# Altium schematic sheet MGMEZZ04_LoopBack.SchDoc
size Letter
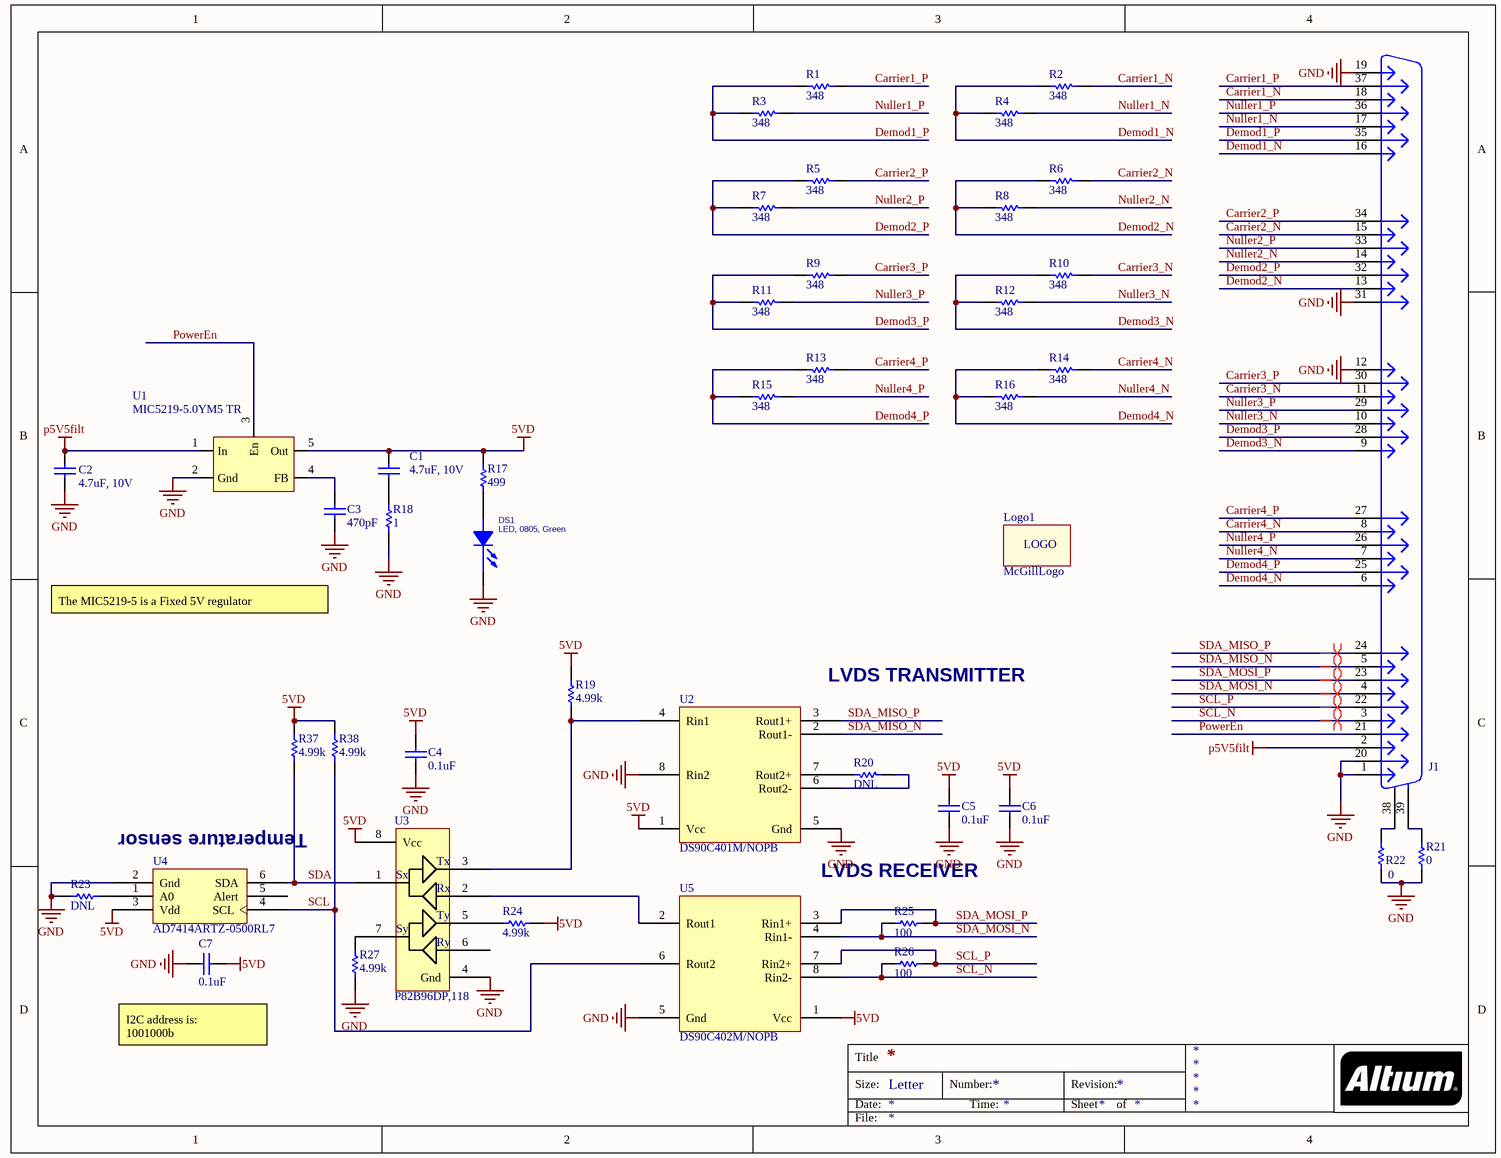
[diagram p0: MGMEZZ04_LoopBack.SchDoc]

## Parts
C1  4.7uF, 10V  [0805]
C2  4.7uF, 10V  [0805]
C3  470pF  [0603]
C4  0.1uF  [0603]
C5  0.1uF  [0603]
C6  0.1uF  [0603]
C7  0.1uF  [0603]
DS1  LED, 0805, Green  [0805L]
J1  DB37M  [DSUB37-M]  (value not drawn)
Logo1  McGillLogo  [McGillLogo1]  (no BOM)
R1  348  [0603]
R2  348  [0603]
R3  348  [0603]
R4  348  [0603]
R5  348  [0603]
R6  348  [0603]
R7  348  [0603]
R8  348  [0603]
R9  348  [0603]
R10  348  [0603]
R11  348  [0603]
R12  348  [0603]
R13  348  [0603]
R14  348  [0603]
R15  348  [0603]
R16  348  [0603]
R17  499  [0603]
R18  1  [0603]
R19  4.99k  [0603]
R20  DNL  [0603]
R21  0  [0603]
R22  0  [0603]
R23  DNL  [0603]
R24  4.99k  [0603]
R25  100  [0603]
R26  100  [0603]
R27  4.99k  [0603]
R37  4.99k  [0603]
R38  4.99k  [0603]
U1  MIC5219-5.0YM5 TR  [SOT23-5]
U2  DS90C401M/NOPB  [SO8]
U3  P82B96DP,118  [MSOP8-P82B96]
U4  AD7414ARTZ-0500RL7  [SOT23-6]
U5  DS90C402M/NOPB  [SO8]

## Nets
5VD: C1.2 C4.2 C5.2 C6.2 C7.2 R17.1 R19.2 R24.2 R37.2 R38.2 U1.5(Out) U2.1(Vcc) U3.8(Vcc) U4.3(Vdd) U5.1(Vcc)
GND: C2.1 C3.1 C4.1 C5.1 C6.1 C7.1 DS1.2(CATHODE) J1.1 J1.12 J1.19 J1.20 J1.31 R18.1 R21.2 R22.1 R23.2 R27.1 U1.2(Gnd) U2.5(Gnd) U2.8(Rin2) U3.4(Gnd) U4.2(Gnd) U5.5(Gnd)
p5V5filt: C2.2 J1.2 U1.1(In)
Carrier1_N: J1.18 R2.2
Carrier1_P: J1.37 R1.2
Carrier2_N: J1.15 R6.2
Carrier2_P: J1.34 R5.2
Carrier3_N: J1.11 R10.2
Carrier3_P: J1.30 R9.2
Carrier4_N: J1.8 R14.2
Carrier4_P: J1.27 R13.2
Demod1_N: J1.16 R2.1 R4.1
Demod1_P: J1.35 R1.1 R3.1
Demod2_N: J1.13 R6.1 R8.1
Demod2_P: J1.32 R5.1 R7.1
Demod3_N: J1.9 R10.1 R12.1
Demod3_P: J1.28 R9.1 R11.1
Demod4_N: J1.6 R14.1 R16.1
Demod4_P: J1.25 R13.1 R15.1
Nuller1_N: J1.17 R4.2
Nuller1_P: J1.36 R3.2
Nuller2_N: J1.14 R8.2
Nuller2_P: J1.33 R7.2
Nuller3_N: J1.10 R12.2
Nuller3_P: J1.29 R11.2
Nuller4_N: J1.7 R16.2
Nuller4_P: J1.26 R15.2
PowerEn: J1.21 U1.3(En)
SCL: R38.1 U4.4(SCL) U5.6(Rout2)
SCL_N: J1.3 R26.1 U5.8(Rin2-)
SCL_P: J1.22 R26.2 U5.7(Rin2+)
SDA: R37.1 U3.1(Sx) U4.6(SDA)
SDA_MISO_N: J1.5 U2.2(Rout1-)
SDA_MISO_P: J1.24 U2.3(Rout1+)
SDA_MOSI_N: J1.4 R25.1 U5.4(Rin1-)
SDA_MOSI_P: J1.23 R25.2 U5.3(Rin1+)
NetC1_1: C1.1 R18.2
NetC3_2: C3.2 U1.4(FB)
NetDS1_1: DS1.1(ANODE) R17.2
NetJ1_38: J1.38(MH1) R22.2
NetJ1_39: J1.39(MH2) R21.1
NetR19_1: R19.1 U2.4(Rin1) U3.3(Tx)
NetR20_1: R20.1 U2.6(Rout2-)
NetR20_2: R20.2 U2.7(Rout2+)
NetR23_1: R23.1 U4.1(A0)
NetR24_1: R24.1 U3.5(Ty)
NetR27_2: R27.2 U3.7(Sy)
NetU3_2: U3.2(Rx) U5.2(Rout1)

Not connected (* = marked no-connect by the designer): U3 6(Ry); U4 5(Alert)

## Layout directives
differential pair: SCL_N, SCL_P, SDA_MISO_N, SDA_MISO_P, SDA_MOSI_N, SDA_MOSI_P

## Notes on the sheet
- The MIC5219-5 is a Fixed 5V regulator
- (near U2) LVDS TRANSMITTER
- (near U4) Temperature sensor
- LVDS RECEIVER
- (near C7) I2C address is:
  1001000b
- Labels drawn without touching a wire or pin: SCL
- Title
- Size:
- Date:
- Letter
- Number:
- Time:
- Revision:
- Sheet
- of
- File:
- (in symbol Logo) LOGO

## Library data of the parts
C1 C2 = CAP 0805: 4.7uF 10V Capacitor, Ceramic, 0805; Manufacturer: Taiyo Yuden; Part Constraints: LMK212BJ475KD-T; Assembly Comments: none; Type: SMD; Value: 4.7uF, 10V; Supplier: Digikey; Supplier Part Number: 587-1297-1-ND; Manufacturer Part Number: LMK212BJ475KD-T; Cost: $0.24
C3 = Cap0603: 470pF Capacitor, Ceramic, 0603; Part Constraints: 470pF 50V 10% X7R 0603; Manufacturer: Kemet; Manufacturer Part Number: C0603C471K5RACTU; Assembly Comments: none; Type: SMD; Value: 470pF; Supplier: Digikey; Supplier Part Number: 399-1075-1-ND; Cost: $0.14
C4-C7 = Cap0603: 0.1uF 0603 Ceramic Capacitor; Part Constraints: 0.1uF 16V 10% X7R; Manufacturer: Kemet; Manufacturer Part Number: C0603C104K4RACTU; Assembly Comments: none; Type: SMD; Value: 0.1uF; Supplier: Digikey; Supplier Part Number: 399-1096-1-ND; Cost: $0.14
DS1 = LED: LED GREEN CLEAR 0805 SMD; Manufacturer: Lite-On Inc; Part constraints: Green LED 0805 2.1V forward voltage 6mcd 10mA; Manufacturer Part Number: LTST-C170GKT; Assembly Comments: none; Supplier: Digikey; Supplier Part Number: 160-1179-1-ND; Value: LED, 0805, Green; Cost: $0.49; Type: SMD
J1 = DB37M: Manufacturer: Norcomp; Part Constraints: 182-037-113R531; Assembly Comments: none; Supplier: Digikey; Supplier Part Number: 182-37ME-ND; Value: DB37M; Manufacturer Part Number: 182-037-113R531; Cost: $4.32; Type: thru-hole
Logo1 = Logo: Silkscreen Logo; Manufacturer: McGill; Assembly Comments: none; Value: McGillLogo; Cost: $0; Type: SMD
R1-R16 = Res0603: 348 Ohm RES 0603; Manufacturer: Vishay Dale; Part constraints: RES 348 OHM 1/10W 1% 0603 SMD; Manufacturer Part Number: CRCW0603348RFKEA; Assembly Comments: none; Value: 348; Supplier: Digikey; Supplier Part Number: 541-348HCT-ND; Cost: $0.124; Type: SMD
R17 = RES 0603: 499 Ohm RES 0603; Manufacturer: Vishay Dale; Part constraints: RES 499 OHM 1/10W 1% 0603 SMD; Manufacturer Part Number: CRCW0603499RFKEA; Assembly Comments: none; Value: 499; Supplier: Digikey; Supplier Part Number: 541-499HCT-ND; Cost: $0.124; Type: SMD
R18 = Res0603: 1 Ohm RES 0603; Manufacturer: Vishay Dale; Part constraints: RES 1 OHM 1/10W 1% 0603 SMD; Manufacturer Part Number: CRCW06031R00FKEA; Assembly Comments: none; Value: 1; Supplier: Digikey; Supplier Part Number: 541-1.00HHCT-ND; Cost: $0.124; Type: SMD
R19 R24 R27 R37 R38 = Res0603: 4.99k Ohm RES 0603; Manufacturer: Vishay Dale; Part constraints: RES 4.99K OHM 1/10W 1% 0603 SMD; Manufacturer Part Number: CRCW06034K99FKEA; Assembly Comments: none; Value: 4.99k; Supplier: Digikey; Supplier Part Number: 541-4.99KHCT-ND; Cost: $0.124; Type: SMD
R20 R23 = Res0603: DO NOT LOAD (DNS); Manufacturer: Generic; Assembly Comments: none; Value: DNL; Part constraints: DNL; Supplier: Digikey; Manufacturer Part Number: DNL; Cost: $0; Type: DNS
R21 R22 = RES 0603: 0 Ohm RES 0603; Manufacturer: Vishay Dale; Part constraints: 0 1/10W 1% 100ppm/C 0603; Manufacturer Part Number: CRCW06030000Z0EA; Assembly Comments: none; Value: 0; Supplier: Digikey; Supplier Part Number: 541-0.0GCT-ND; Cost: $0.114; Type: SMD
R25 R26 = RES 0603: 100 Ohm RES 0603; Manufacturer: Vishay Dale; Part constraints: RES 100 OHM 1/10W 1% 0603 SMD; Manufacturer Part Number: CRCW0603100RFKEA; Assembly Comments: none; Value: 100; Supplier: Digikey; Supplier Part Number: 541-100HCT-ND; Cost: $0.124; Type: SMD
U1 = TPS73601DBVR: Adjustable 30uVrms noise 400mA regulator; Manufacturer: Micrel Inc; Assembly Comments: none; Part Constraints: MIC5219-5.0YM5 TR; Supplier: Digikey; Supplier Part Number: 576-2770-1-ND; Value: MIC5219-5.0YM5 TR; Manufacturer Part Number: MIC5219-5.0YM5 TR; Cost: $2.62; Type: SMD
U2 = DS90C401M/NOPB: IC DRV LVDS DUAL DIFF SGNL 8SOIC; Manufacturer: Texas Instruments; Part Constraints: DS90C401MX/NOPB; Assembly Comments: none; Supplier: Digikey; Supplier Part Number: DS90C401M/NOPB-ND; Value: DS90C401M/NOPB; Manufacturer Part Number: DS90C401MX/NOPB; Cost: $4.64; Type: SMD
U3 = P82B96: IC DUAL BI-DIR BUS BUFFER 8-TSSOP; Assembly Comments: none; Part Constraints: P82B96DP,118; Supplier: Digikey; Supplier Part Number: 568-3197-1-ND; Value: P82B96DP,118; Manufacturer Part Number: P82B96DP,118; Cost: $4.61; Type: SMD
U4 = AD7414ARTZ-0500RL7: Digital Temperature Sensor, 11-Bit, +/-2 Degree Accurate; Manufacturer: Analog Devices; Assembly Comments: none; Footprint: *; Part constraints: AD7414ARTZ-0500RL7; Supplier: Digikey; Supplier Part Number: AD7414ARTZ0500RCT-ND; Value: AD7414ARTZ-0500RL7; Manufacturer Part Number: AD7414ARTZ-0500RL7; Cost: $4.11; Type: SMD
U5 = DS90C402M/NOPB: IC REC LVDS DUAL DIFF SGNL 8SOIC; Manufacturer: Texas Instruments; Part Constraints: DS90C402MX/NOPB; Assembly Comments: none; Supplier: Digikey; Supplier Part Number: DS90C402M/NOPB-ND; Value: DS90C402M/NOPB; Manufacturer Part Number: DS90C402MX/NOPB; Cost: $5.16; Type: SMD